# EAGLE design Controller (EAGLE 9.5.1)

## Sheet 1 of 4
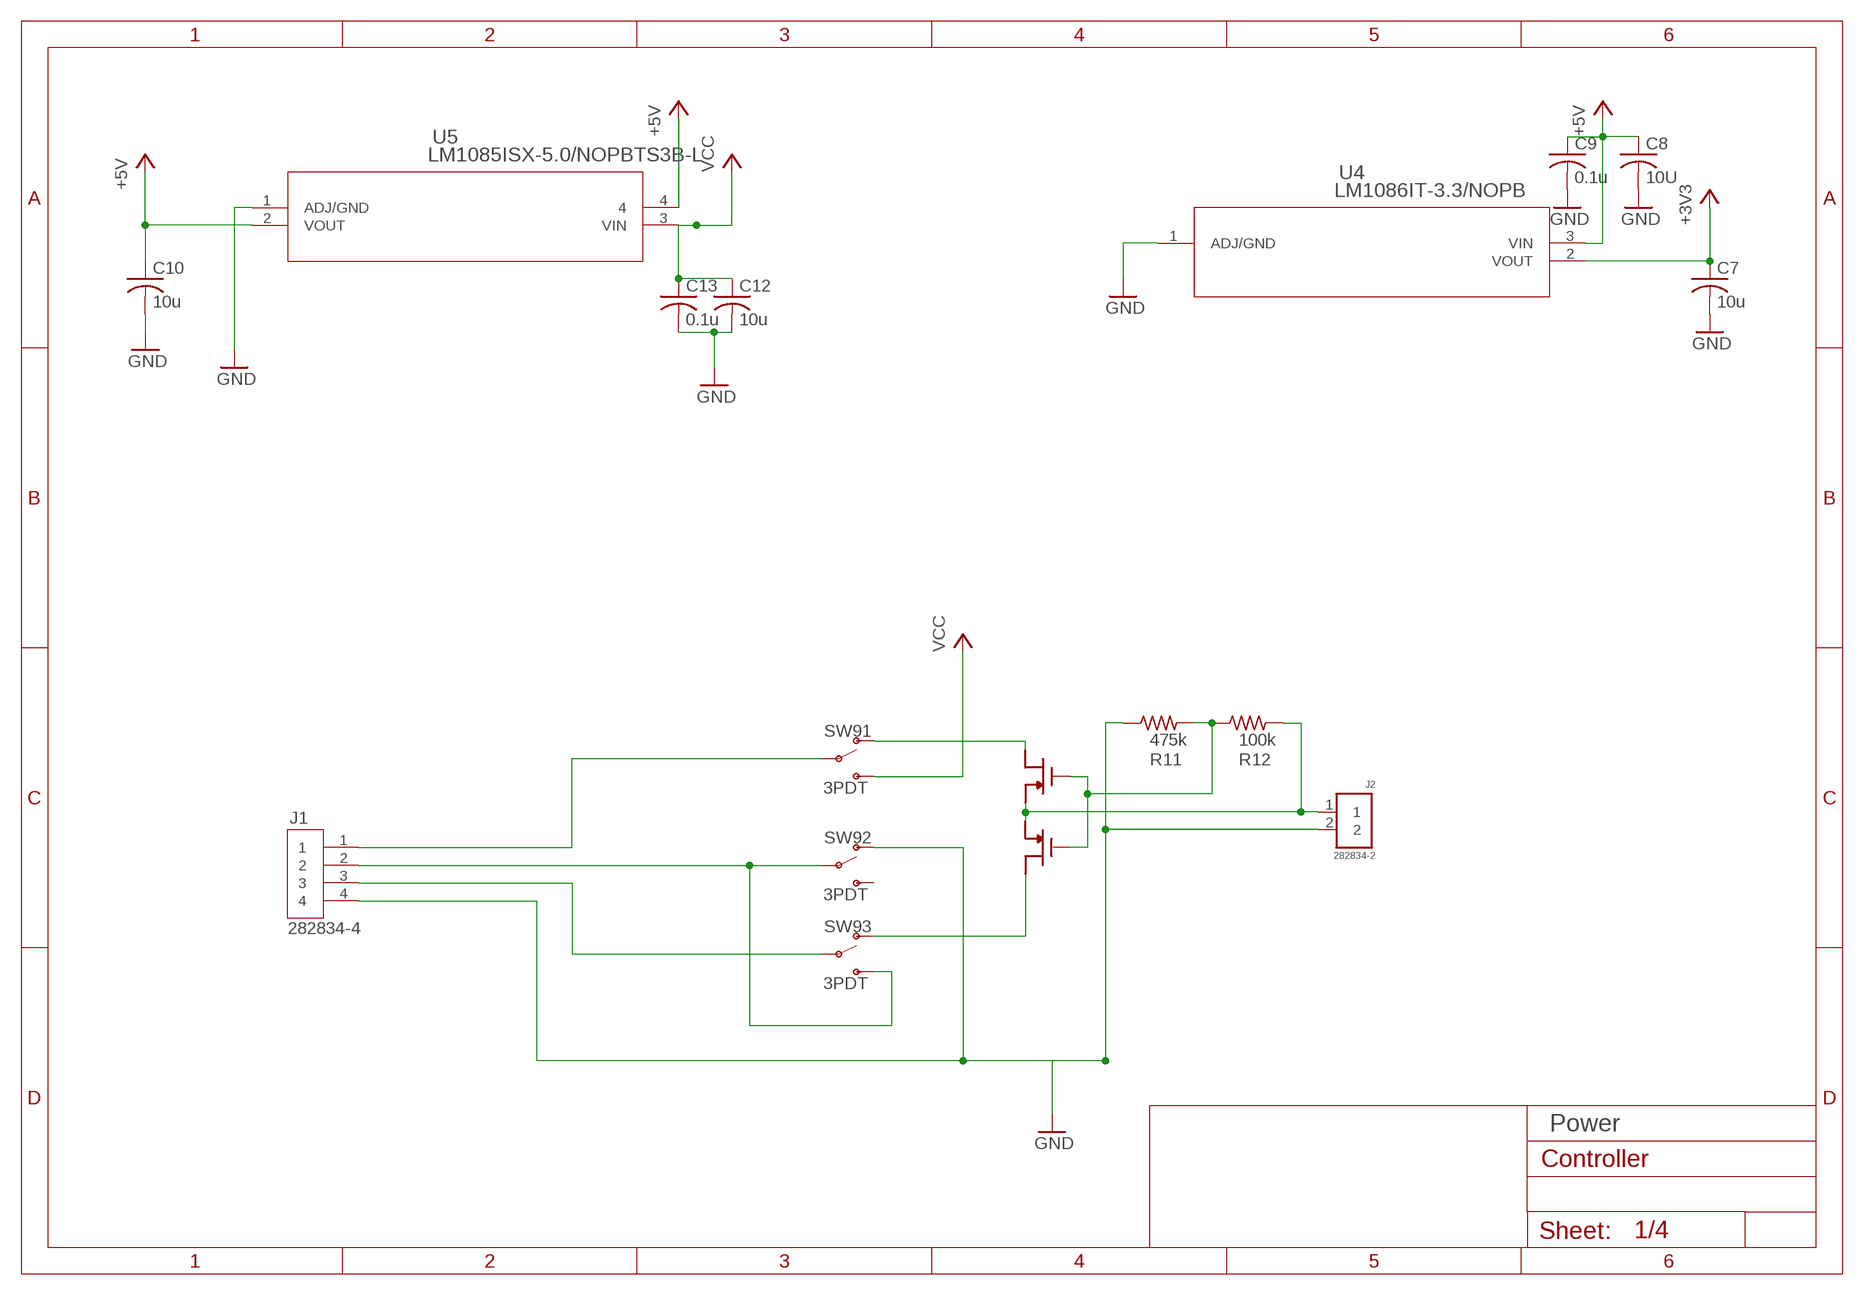
[diagram p0: schematic, sheet 1]

### Parts
C7  10u  C-USC1206  [C1206]
C8  10U  C-USC1206  [C1206]
C9  0.1u  C-USC1206  [C1206]
C10  10u  C-USC1206  [C1206]
C12  10u  C-USC1206  [C1206]
C13  0.1u  C-USC1206  [C1206]
J1  282834-4  [HDRV4W85P254_4X1_1062X650X1000]
J2  282834-2  [CONN_282834-2]
R11  475k  R-US_R1206  [R1206]
R12  100k  R-US_R1206  [R1206]
SW9  3PDT  [3PDT]
U4  LM1086IT-3.3/NOPB  [T03B]
U5  LM1085ISX-5.0/NOPBTS3B-L  [TS3B-L]
U6  SSM6P40TULFCT-ND  [SMD6]

### Nets
+3V3: C7.1 U4.2(VOUT) ; also sheet 4
+5V: C8.1 C9.1 C10.1 U4.3(VIN) U5.2(VOUT) U5.4 ; also sheet 2,3,4
GND: C7.2 C8.2 C9.2 C10.2 C12.2 C13.2 J1.4 J2.2 R11.1 SW9.T21(2:O) U4.1(ADJ/GND) U5.1(ADJ/GND) ; also sheet 2,3,4
N$9: J1.1 SW9.P1(1:P)
N$10: J1.2 SW9.P2(2:P) SW9.T32(3:S)
N$11: J1.3 SW9.P3(3:P)
N$12: SW9.T31(3:O) U6.P$3(D)
N$13: J2.1 R12.2 U6.P$1(S) U6.P$4(S)
N$15: SW9.T11(1:O) U6.P$6(D)
N$19: R11.2 R12.1 U6.P$2(G) U6.P$5(G)
VCC: C12.1 C13.1 SW9.T12(1:S) U5.3(VIN)
Unconnected: SW9.T22(2:S)

### Notes on the sheet
- Power

## Sheet 2 of 4
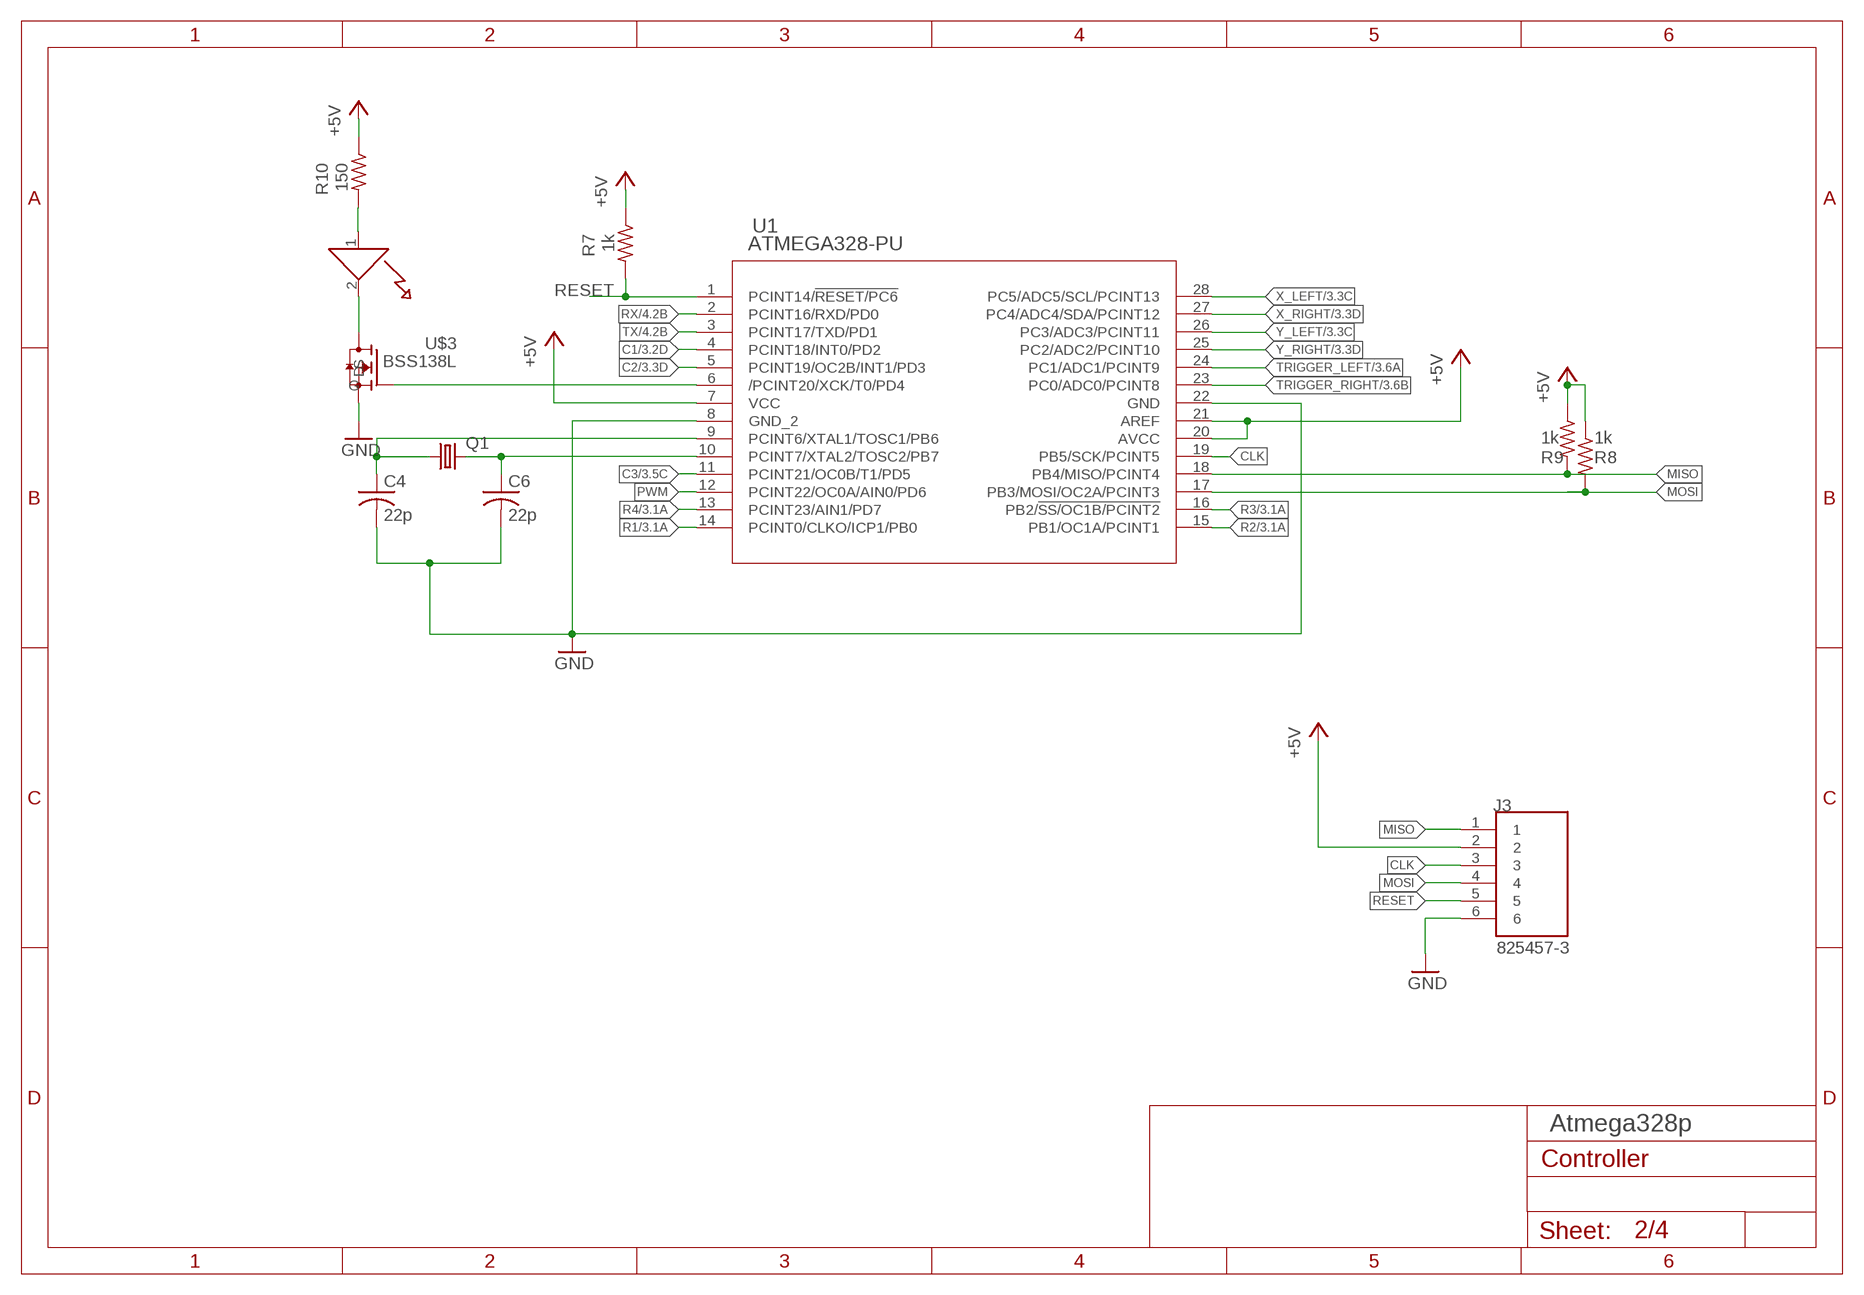
[diagram p1: schematic, sheet 2]

### Parts
C4  22p  C-USC1206  [C1206]
C6  22p  C-USC1206  [C1206]
J3  825457-3  [TE_825457-3]
Q1  CRYSTALHC49S  [HC49/S]
R7  1k  R-US_R1206  [R1206]
R8  1k  R-US_R1206  [R1206]
R9  1k  R-US_R1206  [R1206]
R10  150  R-US_R1206  [R1206]
U1  ATMEGA328-PU  [28P3]
U$2  LED  [R1206W]
U$3  BSS138L  [BSS138L]

### Nets
+5V: J3.2 R7.1 R8.1 R9.1 R10.1 U1.7(VCC) U1.20(AVCC) U1.21(AREF) ; also sheet 1,3,4
C1: U1.4(PCINT18/INT0/PD2) ; also sheet 3
C2: U1.5(PCINT19/OC2B/INT1/PD3) ; also sheet 3
C3: U1.11(PCINT21/OC0B/T1/PD5) ; also sheet 3
CLK: J3.3 U1.19(PB5/SCK/PCINT5)
GND: C4.2 C6.2 J3.6 U1.8(GND_2) U1.22(GND) U$3.S ; also sheet 1,3,4
MISO: J3.1 R9.2 U1.18(PB4/MISO/PCINT4)
MOSI: J3.4 R8.2 U1.17(PB3/MOSI/OC2A/PCINT3)
N$3: C4.1 Q1.1 U1.9(PCINT6/XTAL1/TOSC1/PB6)
N$4: C6.1 Q1.2 U1.10(PCINT7/XTAL2/TOSC2/PB7)
N$6: U1.6(/PCINT20/XCK/T0/PD4) U$3.G
N$7: U$2.2 U$3.D
N$8: R10.2 U$2.1
PWM: U1.12(PCINT22/OC0A/AIN0/PD6)
R1: U1.14(PCINT0/CLKO/ICP1/PB0) ; also sheet 3
R2: U1.15(PB1/OC1A/PCINT1) ; also sheet 3
R3: U1.16(PB2/!SS/OC1B/PCINT2) ; also sheet 3
R4: U1.13(PCINT23/AIN1/PD7) ; also sheet 3
RESET: J3.5 R7.2 U1.1(PCINT14/!RESET/PC6)
RX: U1.2(PCINT16/RXD/PD0) ; also sheet 4
TRIGGER_LEFT: U1.24(PC1/ADC1/PCINT9) ; also sheet 3
TRIGGER_RIGHT: U1.23(PC0/ADC0/PCINT8) ; also sheet 3
TX: U1.3(PCINT17/TXD/PD1) ; also sheet 4
X_LEFT: U1.28(PC5/ADC5/SCL/PCINT13) ; also sheet 3
X_RIGHT: U1.27(PC4/ADC4/SDA/PCINT12) ; also sheet 3
Y_LEFT: U1.26(PC3/ADC3/PCINT11) ; also sheet 3
Y_RIGHT: U1.25(PC2/ADC2/PCINT10) ; also sheet 3

### Notes on the sheet
- Atmega328p

## Sheet 3 of 4
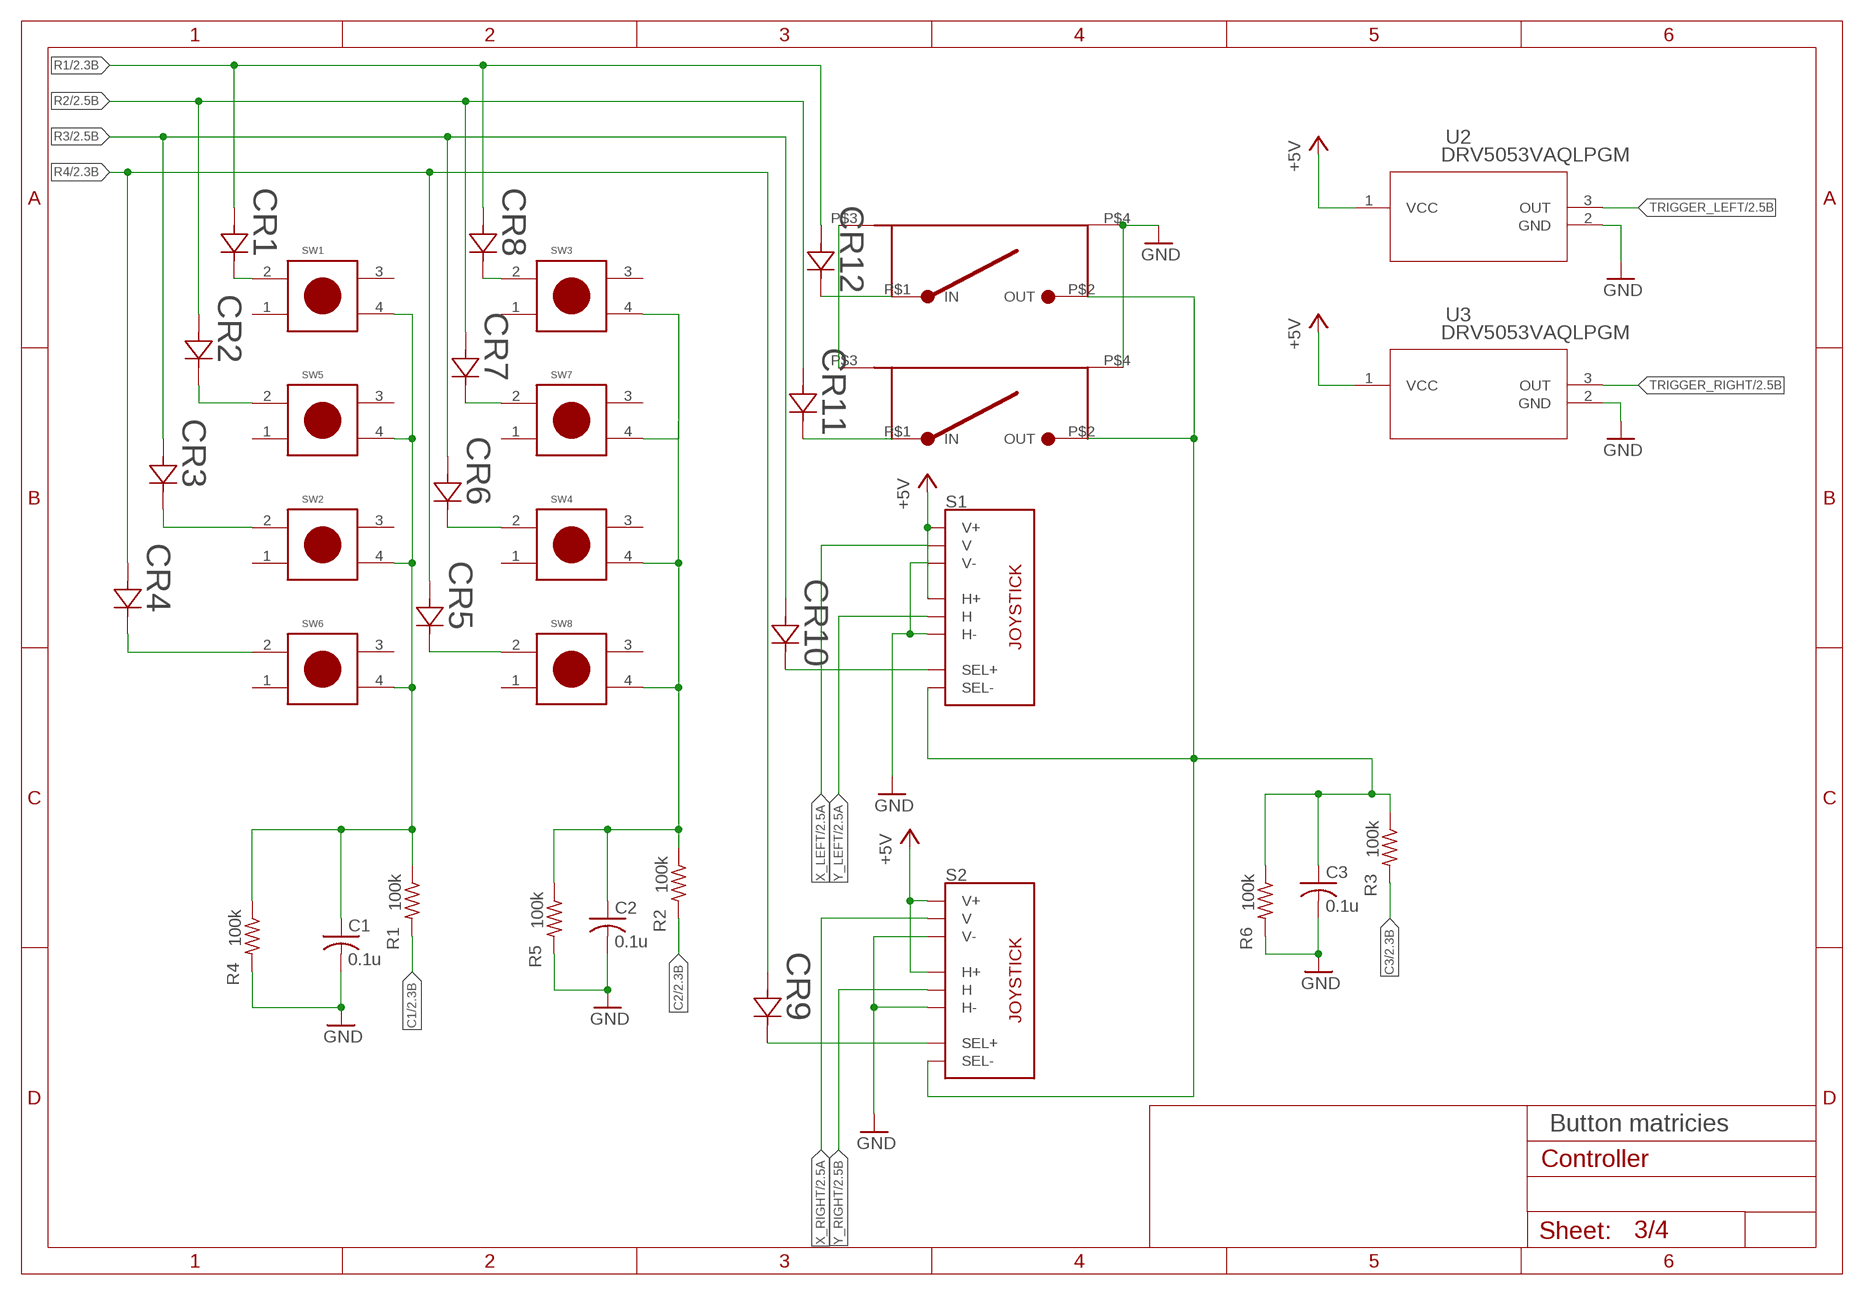
[diagram p2: schematic, sheet 3]

### Parts
C1  0.1u  C-USC1206  [C1206]
C2  0.1u  C-USC1206  [C1206]
C3  0.1u  C-USC1206  [C1206]
CR1  MSS1P6-M3/89ADIODE_MSP3V3-M  [DIODE_MSP3V3-M]
CR2  MSS1P6-M3/89ADIODE_MSP3V3-M  [DIODE_MSP3V3-M]
CR3  MSS1P6-M3/89ADIODE_MSP3V3-M  [DIODE_MSP3V3-M]
CR4  MSS1P6-M3/89ADIODE_MSP3V3-M  [DIODE_MSP3V3-M]
CR5  MSS1P6-M3/89ADIODE_MSP3V3-M  [DIODE_MSP3V3-M]
CR6  MSS1P6-M3/89ADIODE_MSP3V3-M  [DIODE_MSP3V3-M]
CR7  MSS1P6-M3/89ADIODE_MSP3V3-M  [DIODE_MSP3V3-M]
CR8  MSS1P6-M3/89ADIODE_MSP3V3-M  [DIODE_MSP3V3-M]
CR9  MSS1P6-M3/89ADIODE_MSP3V3-M  [DIODE_MSP3V3-M]
CR10  MSS1P6-M3/89ADIODE_MSP3V3-M  [DIODE_MSP3V3-M]
CR11  MSS1P6-M3/89ADIODE_MSP3V3-M  [DIODE_MSP3V3-M]
CR12  MSS1P6-M3/89ADIODE_MSP3V3-M  [DIODE_MSP3V3-M]
R1  100k  R-US_R1206  [R1206]
R2  100k  R-US_R1206  [R1206]
R3  100k  R-US_R1206  [R1206]
R4  100k  R-US_R1206  [R1206]
R5  100k  R-US_R1206  [R1206]
R6  100k  R-US_R1206  [R1206]
S1  THUMBPOINTER-RKJXV1224005  [THUMBPOINTER-RKJXV1224005]
S2  THUMBPOINTER-RKJXV1224005  [THUMBPOINTER-RKJXV1224005]
SW1  MULTICOLOR_BUTTON  [PRT-14460]
SW2  MULTICOLOR_BUTTON  [PRT-14460]
SW3  MULTICOLOR_BUTTON  [PRT-14460]
SW4  MULTICOLOR_BUTTON  [PRT-14460]
SW5  MULTICOLOR_BUTTON  [PRT-14460]
SW6  MULTICOLOR_BUTTON  [PRT-14460]
SW7  MULTICOLOR_BUTTON  [PRT-14460]
SW8  MULTICOLOR_BUTTON  [PRT-14460]
U2  DRV5053VAQLPGM  [LPG3]
U3  DRV5053VAQLPGM  [LPG3]
U$4  BUMPER_BUMPER  [BUMPER_BUMPER]
U$6  BUMPER_BUMPER  [BUMPER_BUMPER]

### Nets
$NC1: C1.1 R1.1 R4.1 SW1.4 SW2.4 SW5.4 SW6.4
+5V: S1.H1(H+) S1.V1(V+) S2.H1(H+) S2.V1(V+) U2.1(VCC) U3.1(VCC) ; also sheet 1,2,4
C1: R1.2 ; also sheet 2
C2: R2.2 ; also sheet 2
C3: R3.2 ; also sheet 2
GND: C1.2 C2.2 C3.2 R4.2 R5.2 R6.2 S1.H3(H-) S1.V3(V-) S2.H3(H-) S2.V3(V-) U2.2(GND) U3.2(GND) U$4.P$4(GROUND) U$6.P$4(GROUND) ; also sheet 1,2,4
N$2: CR4.1 SW6.2
N$5: U$4.P$3(GROUND1) U$6.P$3(GROUND1)
N$16: CR3.1 SW2.2
N$18: CR2.1 SW5.2
N$20: CR1.1 SW1.2
N$21: CR7.1 SW7.2
N$22: CR6.1 SW4.2
N$23: CR5.1 SW8.2
N$24: CR12.1 U$4.P$1(IN)
N$25: CR8.1 SW3.2
N$26: CR11.1 U$6.P$1(IN)
N$27: CR10.1 S1.B1A(SEL+)
N$28: CR9.1 S2.B1A(SEL+)
N$C2: C2.1 R2.1 R5.1 SW3.4 SW4.4 SW7.4 SW8.4
N$C3: C3.1 R3.1 R6.1 S1.B2A(SEL-) S2.B2A(SEL-) U$4.P$2(OUT) U$6.P$2(OUT)
R1: CR1.2 CR8.2 CR12.2 ; also sheet 2
R2: CR2.2 CR7.2 CR11.2 ; also sheet 2
R3: CR3.2 CR6.2 CR10.2 ; also sheet 2
R4: CR4.2 CR5.2 CR9.2 ; also sheet 2
TRIGGER_LEFT: U2.3(OUT) ; also sheet 2
TRIGGER_RIGHT: U3.3(OUT) ; also sheet 2
X_LEFT: S1.V2(V) ; also sheet 2
X_RIGHT: S2.V2(V) ; also sheet 2
Y_LEFT: S1.H2(H) ; also sheet 2
Y_RIGHT: S2.H2(H) ; also sheet 2
Unconnected: SW1.1 SW1.3 SW2.1 SW2.3 SW3.1 SW3.3 SW4.1 SW4.3 SW5.1 SW5.3 SW6.1 SW6.3 SW7.1 SW7.3 SW8.1 SW8.3

### Notes on the sheet
- Button matricies

## Sheet 4 of 4
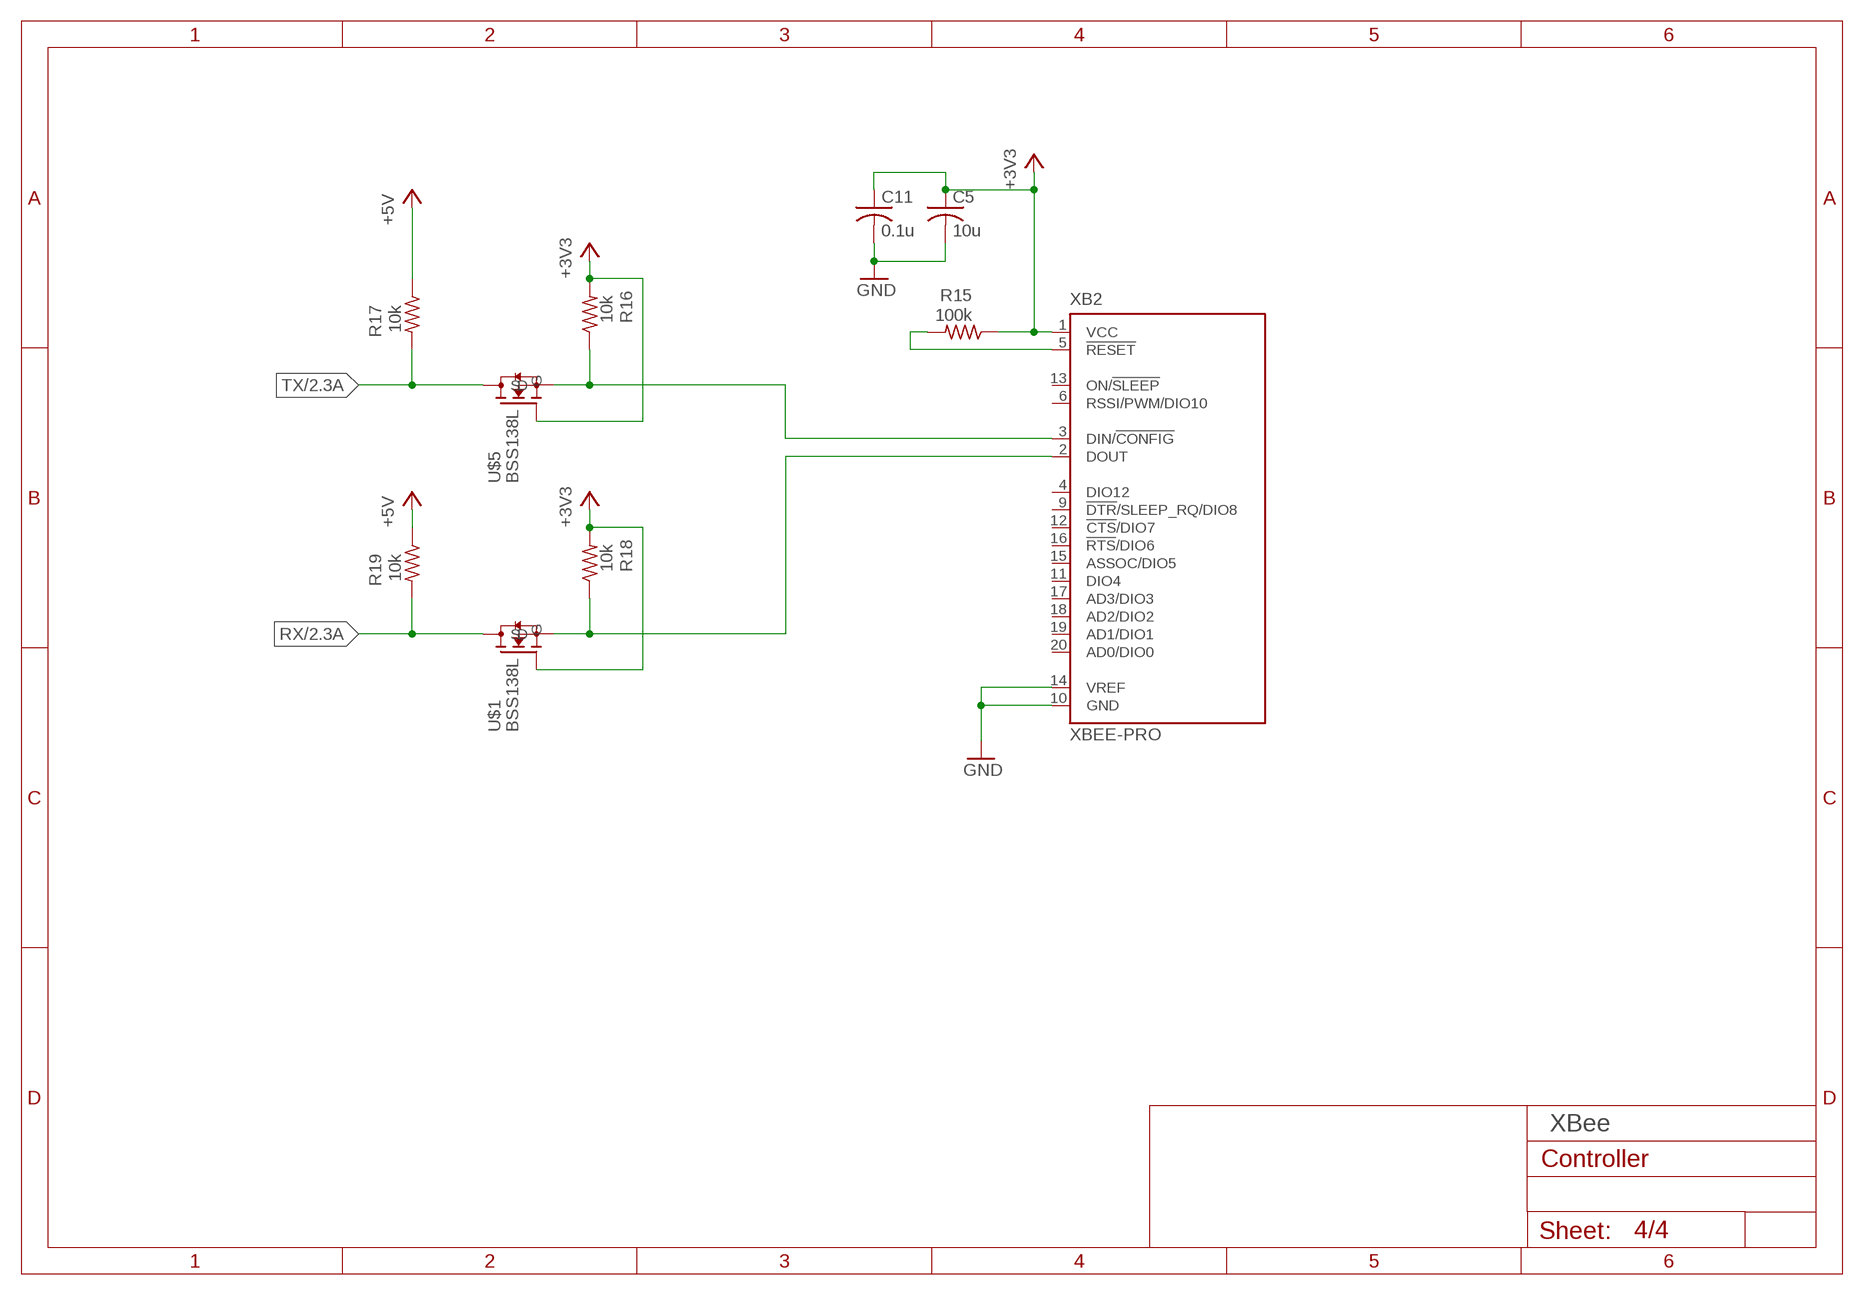
[diagram p3: schematic, sheet 4]

### Parts
C5  10u  C-USC1206  [C1206]
C11  0.1u  C-USC1206  [C1206]
R15  100k  R-US_R1206  [R1206]
R16  10k  R-US_R1206  [R1206]
R17  10k  R-US_R1206  [R1206]
R18  10k  R-US_R1206  [R1206]
R19  10k  R-US_R1206  [R1206]
U$1  BSS138L  [BSS138L]
U$5  BSS138L  [BSS138L]
XB2  XBEE-PRO  [XBEE-PRO]

### Nets
+3V3: C5.1 C11.1 R15.1 R16.2 R18.2 U$1.G U$5.G XB2.1(VCC) ; also sheet 1
+5V: R17.1 R19.1 ; also sheet 1,2,3
GND: C5.2 C11.2 XB2.10(GND) XB2.14(VREF) ; also sheet 1,2,3
N$1: R15.2 XB2.5(!RESET)
N$14: R16.1 U$5.S XB2.3(DIN/!CONFIG)
N$17: R18.1 U$1.S XB2.2(DOUT)
RX: R19.2 U$1.D ; also sheet 2
TX: R17.2 U$5.D ; also sheet 2
Unconnected: XB2.4(DIO12) XB2.6(RSSI/PWM/DIO10) XB2.9(!DTR!/SLEEP_RQ/DIO8) XB2.11(DIO4) XB2.12(!CTS!/DIO7) XB2.13(ON/!SLEEP) XB2.15(ASSOC/DIO5) XB2.16(!RTS!/DIO6) XB2.17(AD3/DIO3) XB2.18(AD2/DIO2) XB2.19(AD1/DIO1) XB2.20(AD0/DIO0)

### Notes on the sheet
- XBee

## Library data of the parts
C1-C13 = rcl:C-US: CAPACITOR, American symbol; SPICEPREFIX: C
CR1-CR12 = Controller:MSS1P6-M3/89A; MANUFACTURER_PART_NUMBER: MSS1P6M389A; VENDOR: Vishay
J1 = 282834-4:282834-4: Wire to Board 4 Position 2.54 mm Pitch 30-16 AWG Euro Style Terminal Block; CENTERLINE_PITCH: 2.54 mm[.1 in]; COMMENT: 282834-4; DESCRIPTION: Conn Terminal Block 4 POS 2.54mm Solder ST Thru-Hole 10A/Contact; DIGI-KEY_PART_NUMBER: A98335-ND; DIGI-KEY_PURCHASE_URL: https://www.digikey.com/product-detail/en/te-connectivity-amp-connectors/282834-4/A98335-ND/1153265?utm_source=snapeda&utm_medium=aggregator&utm_campaign=symbol; EU_ROHS_COMPLIANCE: Compliant with Exemptions; MF: TE Connectivity; MP: 282834-4; NUMBER_OF_POSITIONS: 4; PACKAGE: None; TE_PURCHASE_URL: https://www.te.com/usa-en/product-282834-4.html?te_bu=Cor&te_type=disp&te_campaign=seda_glo_cor-seda-global-disp-prtnr-fy19-seda-model-bom-cta_sma-317_1&elqCampaignId=32493
J2 = 282834-2:282834-2: Terminal block; 2.54mm; angled 90°; 0.03÷1mm2; ways: 2; 10A; H: 10mm; CENTERLINE_PITCH: 2.54 mm[.1 in]; COMMENT: 282834-2; DESCRIPTION: Wire-To-Board Terminal Block, 2, 150 V, 10 A, 30 Awg, 16 Awg, 1.4 Mm; DIGI-KEY_PART_NUMBER: A98333-ND; DIGI-KEY_PURCHASE_URL: https://www.digikey.com/product-detail/en/te-connectivity-amp-connectors/282834-2/A98333-ND/1150135?utm_source=snapeda&utm_medium=aggregator&utm_campaign=symbol; EU_ROHS_COMPLIANCE: Compliant with Exemptions; MF: TE Connectivity; MP: 282834-2; NUMBER_OF_POSITIONS: 2; PACKAGE: None; TE_PURCHASE_URL: https://www.te.com/usa-en/product-282834-2.html?te_bu=Cor&te_type=disp&te_campaign=seda_glo_cor-seda-global-disp-prtnr-fy19-seda-model-bom-cta_sma-317_1&elqCampaignId=32493
J3 = 825457-3:825457-3: MOD\ II\ HSG\ R\.A\.\ 3\ POS; CENTERLINE_PITCH: 2.54 mm[.1 in]; COMMENT: 825457-3; DESCRIPTION: MOD II HSG R.A. 3 POS; DIGI-KEY_PART_NUMBER: A122907-ND; DIGI-KEY_PURCHASE_URL: https://www.digikey.com/product-detail/en/te-connectivity-amp-connectors/825457-3/A122907-ND/5008513?utm_source=snapeda&utm_medium=aggregator&utm_campaign=symbol; EU_ROHS_COMPLIANCE: Compliant; MF: TE Connectivity; MP: 825457-3; NUMBER_OF_POSITIONS: 6; PACKAGE: None; PRODUCT_TYPE: Connector; TE_PURCHASE_URL: https://www.te.com/usa-en/product-825457-3.html?te_bu=Cor&te_type=disp&te_campaign=seda_glo_cor-seda-global-disp-prtnr-fy19-seda-model-bom-cta_sma-317_1&elqCampaignId=32493
Q1 = crystal:CRYSTAL: CRYSTAL; OC_FARNELL: 1667008; OC_NEWARK: unknown
R1-R12 R15-R19 = rcl:R-US_: RESISTOR, American symbol; SPICEPREFIX: R
S1 S2 = Controller:THUMBPOINTER-RKJXV1224005: ThumbPointer - RK JXV1224005 This is a joystick very similar to the joysticks on Xbox One and PS4 controllers. Directional movements are simply two potentiometers - one for each axis. Pots are ~10k each. This joystick also has a select button that is actuated when the joystick is pressed down. Additional Information <https://www.alps.com/prod/info/E/HTML/MultiControl/Potentiometer/RKJXK/RKJXV1224005.html>; PROD_ID: RKJXV1224005
SW1-SW8 = Controller:MULTICOLOR_BUTTON; SPICEPREFIX: S
SW9 = Controller:3PDT; DIGIKEY_PART_NUMBER: CWI359-ND
U1 = Controller:ATMEGA328-PU; MANUFACTURER_PART_NUMBER: ATMEGA328PU; VENDOR: Atmel
U2 U3 = Controller:DRV5053VAQLPGM; MANUFACTURER_PART_NUMBER: DRV5053VAQLPGM; VENDOR: Texas Instruments
U4 = Controller:LM1086IT-3.3/NOPB; MANUFACTURER_PART_NUMBER: LM1086IT3.3NOPB; VENDOR: Texas Instruments
U5 = Controller:LM1085ISX-5.0/NOPB; MANUFACTURER_PART_NUMBER: LM1085ISX5.0NOPB; VENDOR: Texas Instruments
U6 = Controller:SSM6P40TULFCT-ND; DIGIKEY_PART_NUMBER: SSM6P40TULFCT-ND
U$1 U$3 U$5 = BSS138L:BSS138L: BSS138L N-Channel Logic Level Enhancement Mode Field Effect Transistor; DESCRIPTION: Small Signal MOSFET 50V 200mA 3.5 Ohm Single N-Channel SOT-23 Logic Level; DIGI-KEY_PART_NUMBER: BSS138LCT-ND; DIGI-KEY_PURCHASE_URL: https://www.digikey.com/product-detail/en/on-semiconductor/BSS138L/BSS138LCT-ND/5044761?utm_source=snapeda&utm_medium=aggregator&utm_campaign=symbol; MF: ON Semiconductor; MP: BSS138L; PACKAGE: SOT-23 ON Semiconductor
U$2 = Controller:LED
U$4 U$6 = Controller:BUMPER_BUMPER
XB2 = Controller:XBEE: XBee (TM) /XBee-PRO(TM) OEM RF Modules Source: MaxStream, Inc. xbee_productmanual.pdf; MPN: XBP24-AWI-001; OC_FARNELL: 1337916; OC_NEWARK: 42M2667

## Board
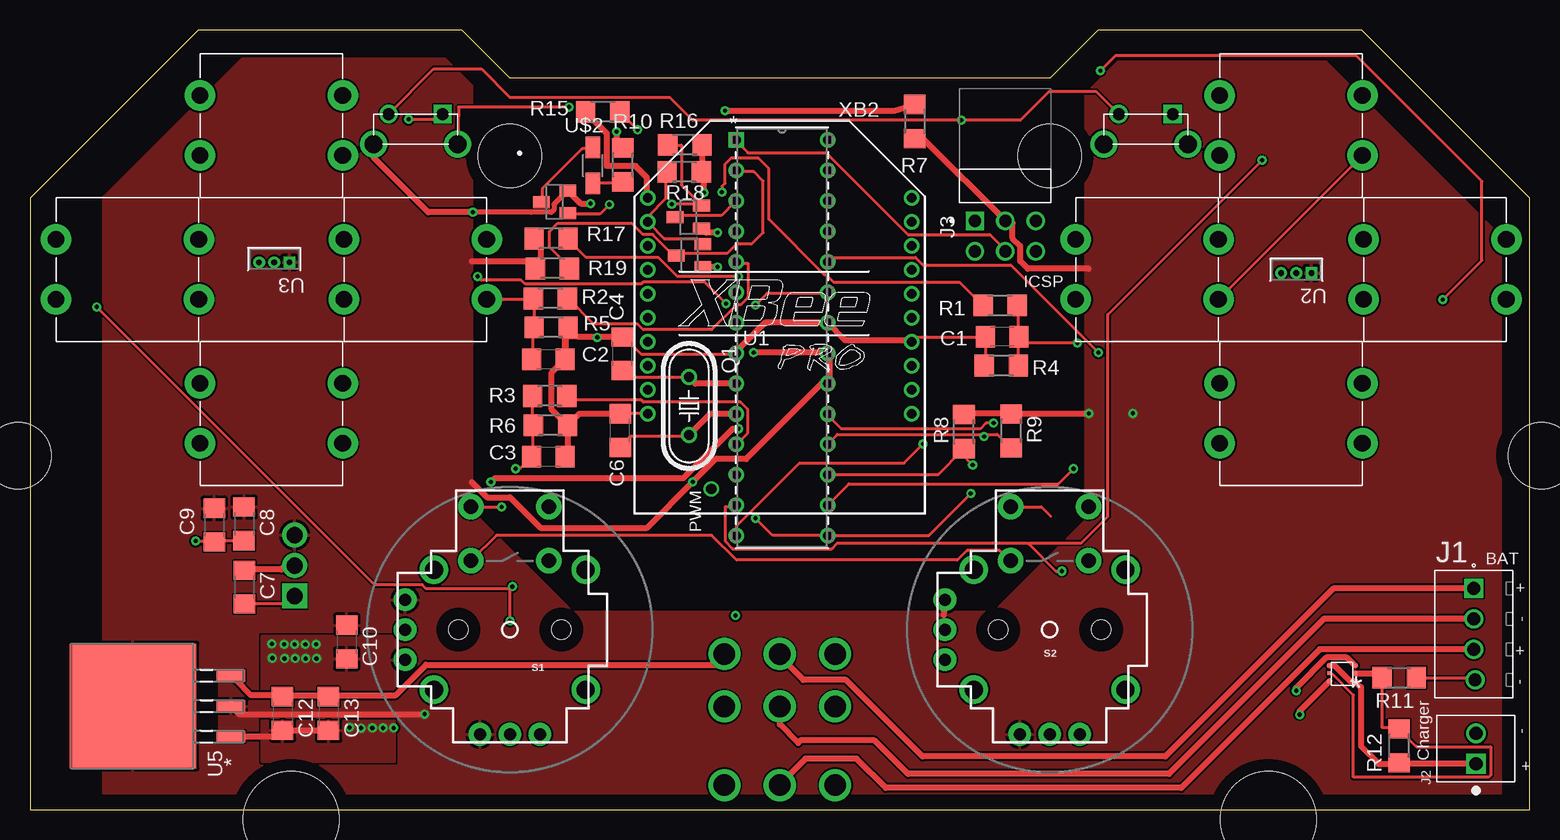
[diagram p4: board, top side]
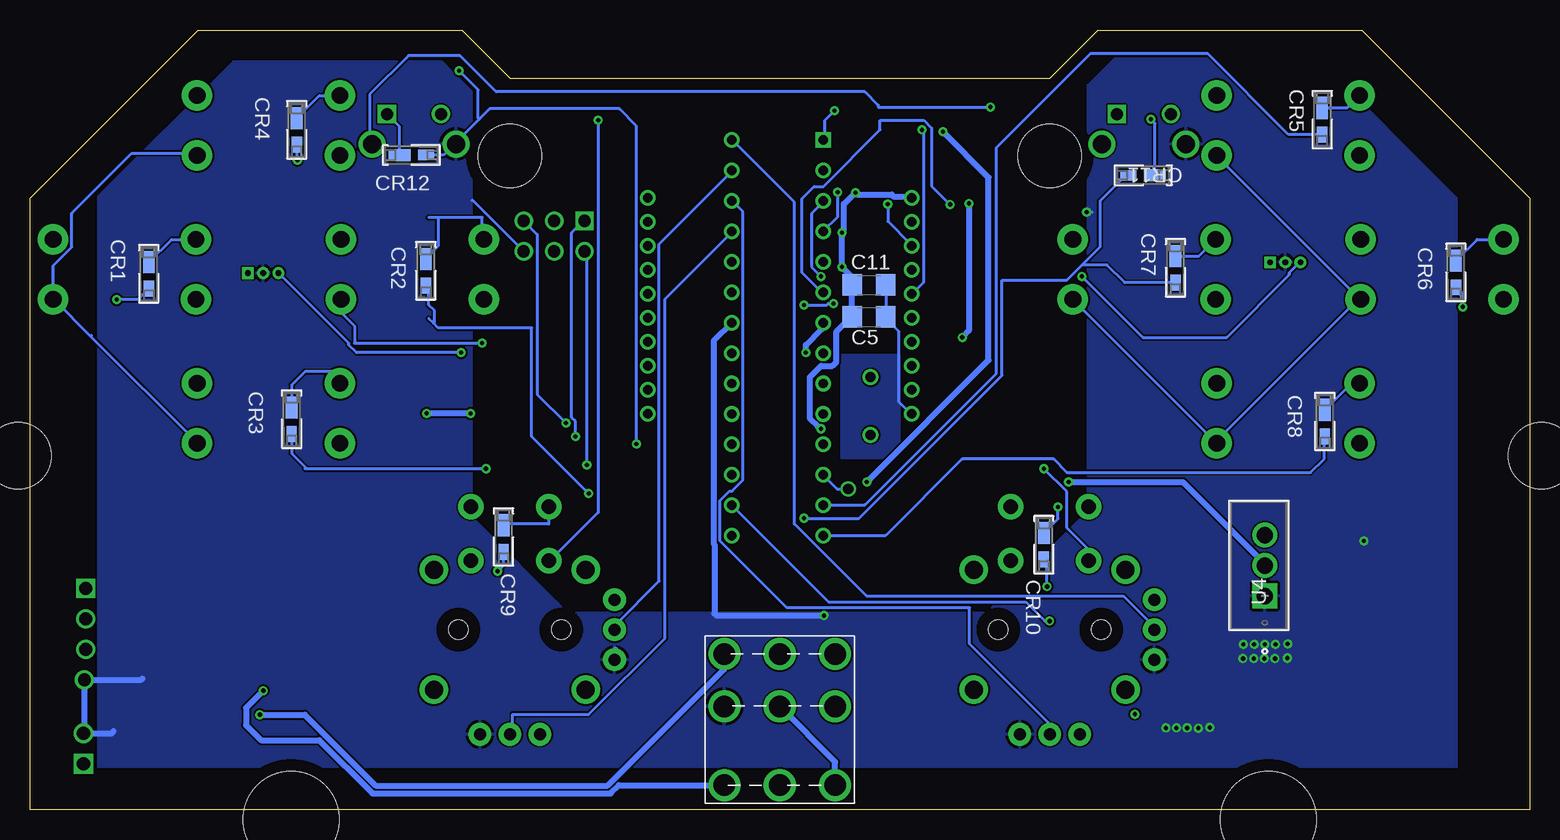
[diagram p5: board, bottom side, seen from below]

Size 125 x 65 mm. Coordinates in mm from the lower left corner, seen from the top.
Outline: 0,0 125,0 125,51 111,65 89,65 85,61 40,61 36,65 14,65 0,51 0,0
Copper layers (1*16): Top 0.035mm / dielectric 1.5mm / Bottom 0.035mm
Design rules "default *": minimum track width 10mil, minimum drill 0.35mm, track to track 6mil, track to pad 6mil, pad to pad 6mil, via to via 6mil, smd to smd 6mil, copper to edge 40mil, drill to drill 6mil, minimum pad ring 10mil, minimum via ring 8mil, stop-mask expansion 4mil, vias tented up to drill 0mil, thermal gap 10mil
Holes 5.5 mm at -1,29.5 126,29.5
Holes 8 mm at 21.77,-0.83 103.23,-0.83
Holes 5.25 mm at 40,54.5 85,54.5
tKeepout: area 52.6,29.4 to 57.3,38
bKeepout: area 52.5,29.3 to 57.4,38

### Footprints (pad centres in the part's own frame; a part is rotated, then mirrored left to right if it is on the bottom)
C1206 = smd 1.6 x 1.8: 1 -1.4,0; 2 1.4,0
DIODE_MSP3V3-M = smd 1.854 x 0.991: 1 -0.978,0 | smd 1.321 x 0.864: 2 1.245,0
HDRV4W85P254_4X1_1062X650X1000 = drill 1.06 square: 1 0,0 | drill 1.06: 2 2.54,0; 3 5.08,0; 4 7.62,0.1
CONN_282834-2 = drill 1.1 square: 1 -1.27,0 | drill 1.1: 2 1.27,0
TE_825457-3 = drill 1.016 square: 1 0,0 | drill 1.016: 2 2.54,0; 3 5.08,0; 4 0,-2.54; 5 2.54,-2.54; 6 5.08,-2.54
HC49/S = drill 0.813: 1 -2.413,0; 2 2.413,0
R1206 = smd 1.6 x 1.803: 1 -1.422,0; 2 1.422,0
THUMBPOINTER-RKJXV1224005 = drill 1.2 pad 2.1: B1A -3.25,10.25; B1B 3.25,10.25; B2A -3.25,5.75; B2B 3.25,5.75 | drill 1 pad 1.9: H1 -2.5,-8.73; H2 0,-8.73; H3 2.5,-8.73; V1 -8.73,2.5; V2 -8.73,0; V3 -8.73,-2.5 | drill 1.5 pad 2.4: MOUNT1 -6.325,5; MOUNT2 -6.325,-5; MOUNT3 6.325,-5; MOUNT4 6.325,5 | hole 1.6: -4.3,0; 4.3,0
PRT-14460 = drill 1.4 pad 2.54: 1 -5.83,-2.46; 2 -5.83,2.54; 3 6.07,2.54; 4 6.07,-2.46
3PDT = drill 1.778: P1 0,5.461; P2 0,1.092; P3 0,-5.461; T11 -4.623,5.461; T12 4.623,5.461; T21 -4.623,1.092; T22 4.623,1.092; T31 -4.623,-5.461; T32 4.623,-5.461
28P3 = drill 0.787 pad 1.295 square: 1 -7.62,33.02 | drill 0.787 pad 1.295: 2 -7.62,30.48; 3 -7.62,27.94; 4 -7.62,25.4; 5 -7.62,22.86; 6 -7.62,20.32; 7 -7.62,17.78; 8 -7.62,15.24; 9 -7.62,12.7; 10 -7.62,10.16; 11 -7.62,7.62; 12 -7.62,5.08; 13 -7.62,2.54; 14 -7.62,0; 15 0,0; 16 0,2.54; 17 0,5.08; 18 0,7.62; 19 0,10.16; 20 0,12.7; 21 0,15.24; 22 0,17.78; 23 0,20.32; 24 0,22.86; 25 0,25.4; 26 0,27.94; 27 0,30.48; 28 0,33.02
LPG3 = drill 0.48 square: 1 -2.54,0 | drill 0.48: 2 -1.27,0; 3 0,0
T03B = drill 1.372 pad 1.88 square: 1 -5.08,-1.016 | drill 1.372 pad 1.88: 2 -2.54,-1.016; 3 0,-1.016
TS3B-L = smd 0.965 x 2.388: 1 -2.54,-8.23; 2 0,-8.23; 3 2.54,-8.23 | smd 10.414 x 10.566: 4 0,-0.051
SMD6 = smd 0.4 x 0.3: P$1 -1.05,0.65; P$2 -1.05,0; P$3 -1.05,-0.65; P$4 1.05,-0.65; P$5 1.05,0; P$6 1.05,0.65
BSS138L = smd 1 x 1.4: D 0,1.1; G -0.95,-1.1; S 0.95,-1.1
R1206W = smd 1.8 x 1.2: 1 -1.499,0; 2 1.499,0
BUMPER_BUMPER = drill 1 pad 1.5 square: P$1 -2.25,0 | drill 1 pad 1.5: P$2 2.25,0 | drill 1.5 pad 2: P$3 -3.5,2.5; P$4 3.5,2.5
XBEE-PRO = drill 0.8 pad 1.27: 1 -11,9; 2 -11,7; 3 -11,5; 4 -11,3; 5 -11,1; 6 -11,-1; 7 -11,-3; 8 -11,-5; 9 -11,-7; 10 -11,-9; 11 11,-9; 12 11,-7; 13 11,-5; 14 11,-3; 15 11,-1; 16 11,1; 17 11,3; 18 11,5; 19 11,7; 20 11,9

### Placement (x,y rotation side)
C1  81.05,39.42 180 top
C2  43.22,37.55 0 top
C3  43.22,29.43 0 top
C4  49.38,38 90 top
C5  55.06,41.08 0 bottom
C6  49.2,31.59 90 top
C7  17.87,18.55 270 top
C8  17.84,23.82 270 top
C9  15.37,23.72 270 top
C10  26.41,13.97 270 top
C11  55.06,43.74 0 bottom
C12  21.05,8.02 270 top
C13  24.88,8.01 270 top
CR1  115.09,44.67 270 bottom
CR2  92,44.92 270 bottom
CR3  103.19,32.55 270 bottom
CR4  102.76,56.67 270 bottom
CR5  17.29,57.52 270 bottom
CR6  6.14,44.79 270 bottom
CR7  29.51,45.17 270 bottom
CR8  17.06,32.35 270 bottom
CR9  85.53,22.73 270 bottom
CR10  40.49,22.09 270 bottom
CR11  32.2,52.89 180 bottom
CR12  93.21,54.58 0 bottom
J1  120.36,18.44 270 top
J2  120.54,5.08 90 top
J3  78.76,49.09 0 top
Q1  54.94,33.65 270 top
R1  80.88,42.04 180 top
R2  43.38,42.6 0 top
R3  43.33,34.48 0 top
R4  80.96,37.02 180 top
R5  43.44,40.2 0 top
R6  43.39,32.04 0 top
R7  73.74,57.36 90 top
R8  77.85,31.51 270 top
R9  81.8,31.56 270 top
R10  49.42,53.75 270 top
R11  114.14,11 180 top
R12  114.14,5.31 270 top
R15  47.74,58.17 0 top
R16  54.59,55.43 0 top
R17  43.44,47.6 0 top
R18  54.53,53.16 0 top
R19  43.54,45.1 0 top
S1  40,15 0 top
S2  85,15 0 top
SW1  117,45 0 top
SW2  105,33 0 top
SW3  20,33 0 top
SW4  8,45 0 top
SW5  93,45 0 top
SW6  105,57 0 top
SW7  32,45 0 top
SW8  20,57 0 top
SW9  62.5,7.5 0 bottom
U1  66.5,22.82 0 top
U2  104.29,44.74 180 top
U3  19.09,45.63 180 top
U4  23.08,22.89 90 bottom
U5  8.53,8.62 90 top
U6  109.39,11.36 180 top
U$1  54.98,46.2 90 top
U$2  46.91,53.7 90 top
U$3  43.73,50.66 90 top
U$4  93,58 180 top
U$5  54.88,49.39 90 top
U$6  32.16,58 180 top
XB2  62.5,42 0 top

### Tracks (layer width: path | path; a pad name or v marks a point on that pad's centre or on a via)
$NC1  (via drill 0.35)
  Top 0.254: 82.39,38.89 82.39,37.15 R4.1 | 82.39,38.89 82.39,39.37 C1.1 | R1.1 82.39,41.91 82.39,39.53 C1.1 | v87.31,38.89 82.39,38.89 | 82.39,38.89 C1.1 | SW5.4 SW6.4
  Bottom 0.254: v87.31,38.89 97.95,38.89 97.95,40.32 99.06,41.43 99.06,42.39 SW5.4 99.22,42.55 | 119.94,39.45 123.03,42.55 SW1.4 123.07,45.35 121.52,46.9 121.52,49.72 116.51,54.73 111.24,54.73 110.97,54.45 | 119.94,39.45 111.12,30.64 SW2.4 | 111.12,54.45 SW6.4 110.97,54.45 | 119.86,39.53 119.94,39.45 | 110.97,54.45 110.97,54.29
+3V3  (via drill 0.35)
  Top 0.508: R15.1 46.35,58.1 48.1,56.36 48.1,53.66 50.48,53.66 51.44,52.7 51.44,51.12 XB2.1 | C7.1 17.94,20 20.95,20 21.27,20.32 21.91,20.32 U4.2 | R16.2 56.04,55.4 56.04,53.18 R18.2 56.2,53.02 v56.2,51.44 | v57.31,45.24 56.2,45.24 U$1.G | v57.31,48.1 56.36,48.1 56.04,48.42 U$5.G | v38.42,27.3 38.73,27.62 54.45,27.62 58.58,31.75 v59.05,31.75
  Bottom 0.508: v38.42,27.3 28.89,27.3 22.07,20.48 U4.2 | XB2.1 51.59,51.12 53.02,51.12 53.18,51.28 56.04,51.28 v56.2,51.44 57.15,50.48 57.15,48.26 v57.31,48.1 v57.31,45.24 56.52,44.45 56.52,43.81 C11.1 56.52,43.5 56.52,41.12 C5.1 56.67,40.96 57.78,39.85 57.78,37.32 58.11,36.99 59.05,36.99 60.01,36.04 60.01,32.62 59.32,31.93 59.23,31.93 v59.05,31.75
+5V  (via drill 0.35)
  Top 0.508: v48.9,56.52 48.9,55.24 R10.1 | v60.33,38.1 66.04,38.1 U1.21 66.67,37.47 66.67,35.56 U1.20 66.04,35.56 59.69,29.21 57.15,29.21 v55.24,27.3 51.44,23.5 42.55,23.5 40.01,26.04 38.1,26.04 36.83,27.3 | R8.1 78.11,33.02 81.28,33.02 R9.1 81.92,33.02 v88.27,33.02 | R17.1 42.55,46.99 42.55,45.72 R19.1 41.91,45.72 36.83,45.72 | 88.27,45.09 83.19,45.09 82.55,45.72 82.55,46.99 81.92,47.62 81.92,48.9 J3.2 74.45,55.94 R7.1 | S2.V1 76.2,17.14 76.2,16.51 76.15,16.22 | U5.2 17.43,7.95 v32.9,7.95
  Bottom 0.508: v48.9,56.52 45.09,52.7 45.09,37.47 v55.24,27.3 | v60.33,38.1 60.33,38.73 59.05,40.01 U1.7 | v88.27,33.02 91.94,33.02 91.95,33.02 v91.94,33.04
  pour Top (rank 2): 6.06,51.01 6.06,1.35 122.66,1.35 122.66,47.76 108.06,62.36 90.66,62.36 87.95,59.65 87.95,24.1 80.33,16.48 45.26,16.48 36.89,24.85 36.89,60.34 34.62,62.6 17.65,62.6
C1  (via drill 0.35)
  Top 0.254: R1.2 79.38,42.07 77.47,43.97 66.99,43.97 66.36,44.61 66.2,44.61 61.59,49.21 61.59,53.42 60.73,54.29 58.42,54.29 57.94,53.82 57.94,52.23 57.67,51.96 v57.67,51.49 | 58.9,48.26 U1.4
  Bottom 0.254: v57.67,51.49 57.67,50.71 57.68,50.7 57.68,49.42 U1.4
C2
  Top 0.254: R2.2 44.93,42.55 46.99,40.48 50.64,40.48 51.12,40.01 56.83,40.01 58.9,42.07 59.21,42.07 59.85,42.7 59.85,45.56 58.9,45.56 U1.5
C3
  Top 0.254: R3.2 44.77,34.45 45.09,34.13 50.96,34.13 51.12,33.97 59.21,33.97 59.85,33.34 59.85,31.41 U1.11
CLK  (via drill 0.35)
  Top 0.254: v80.33,32.23 79.69,32.23 79.22,31.75 67.63,31.75 66.52,32.86 U1.19
  Bottom 0.254: v80.33,32.23 82.71,34.61 82.71,47.94 83.82,49.05 J3.3
GND  (via drill 0.35)
  Top 0.254: XB2.10 51.44,33.02 49.54,33.02 49.21,33.02 C6.2 49.05,32.86 45.72,32.86 44.93,32.07 R6.2 | R4.2 79.69,37.15 79.69,39.37 C1.2 79.53,39.37 73.82,39.37 73.59,39.14 73.5,39.05 XB2.14 73.34,39.05 | 44.77,39.37 44.77,40.16 R5.2 44.77,39.37 | 44.77,39.37 44.77,37.62 C2.2 | 44.77,39.37 v47.29,39.37 49.37,39.37 C4.2 49.53,39.37 50.96,37.94 58.6,37.94 58.74,37.94 U1.8 58.9,38.1 61.28,40.48 66.36,40.48 U1.22 66.52,40.48 | C8.2 17.78,22.38 15.4,22.38 C9.2 15.24,22.38 v13.81,22.38 | C7.2 17.94,17.14 21.27,17.14 21.91,17.78 U4.1 | R11.1 115.57,10.95 120.33,10.95 J1.4 | 28.66,54.34 U$6.P$4
  Top 0.406: U$3.S 43.68,50.47 43.68,50.02 43.47,49.81 41.78,49.81 41.77,49.81 v36.92,49.81
  Top 0.508: U5.1 20.52,6.08 C12.2 C13.2 | v36.92,49.81 33.19,49.81 30.25,52.75 28.66,54.34 | R6.2 44.8,32.04 43.5,33.34 43.5,36.44 C2.2 44.62,39.96 R5.2 45.66,39.4 C4.2 | R6.2 45.79,33.02 49.54,33.02 | R6.2 44.81,29.16 44.56,28.91 44.56,29.38 C3.2 | U$3.S 45.9,50.54 v46.74,50.54 | 58.6,37.94 61.26,40.6 U1.22 67.96,39.14 73.59,39.14
  Bottom 0.254: C11.2 53.66,43.66 53.66,41.12 C5.2 53.66,40.96 52.55,39.85 52.55,33.97 51.59,33.02 XB2.10 | 36.44,49.81 v36.92,49.81 | J3.6 83.98,46.67 88.11,50.8 88.15,50.8
  Bottom 0.508: 115.61,10.93 115.72,10.82 J1.4 120.46,6.42 J2.2 118.22,6.34 118.03,6.54 | 76.2,13.34 S2.V3 | v46.74,50.54 46.74,39.92 v47.29,39.37 | U1.22 68,39.1 68,22.16 67.94,22.11 67.94,16.35 67.76,16.17 v58.81,16.17
  other vias: 20.16,13.81 21.18,13.78 22.06,13.78 22.95,13.78 23.84,13.78 20.2,12.62 21.21,12.59 22.1,12.59 22.99,12.59 23.88,12.59 26.64,6.84 27.61,6.79 28.54,6.8 29.43,6.8 30.32,6.8
  pour Bottom (rank 2): 6.05,51 17.65,62.6 34.62,62.6 36.86,60.36 36.86,24.84 45.29,16.41 80.17,16.41 88.15,24.39 88.15,59.88 90.65,62.38 108.08,62.38 119.36,51.09 119.36,3.55 6.05,3.55
  pour Bottom: 52.54,37.92 52.54,29.29 57.34,29.29 57.34,37.92
  pour Top: 19.32,14.44 19.32,4.01 30.4,4.01 30.4,14.45 19.32,14.45
MISO  (via drill 0.35)
  Top 0.254: 79.53,31.27 67.31,31.27 66.52,30.48 U1.18 | 79.53,31.27 80.64,31.27 81.76,30.16 R9.2 | 79.53,31.27 v79.53,31.11
  Bottom 0.254: v79.53,31.11 79.53,32.38 79.85,32.7 79.85,48.1 78.9,49.05 J3.1
MOSI  (via drill 0.35)
  Top 0.254: U1.17 66.52,27.94 75.72,27.94 77.79,30 R8.2 77.63,29.69 v78.58,28.73
  Bottom 0.254: v78.58,28.73 78.58,46.35 78.74,46.51 J3.4
N$1  (via drill 0.35)
  Top 0.254: v50.64,56.67 49.21,58.1 R15.2
  Bottom 0.254: v50.64,56.67 50.48,56.52 50.48,43.97 51.44,43.02 XB2.5
N$2
  Bottom 0.254: 99.22,60.01 99.22,59.69 SW6.2 100.88,59.54 CR4.1
N$3
  Top 0.254: C4.1 49.53,36.51 50.01,36.04 54.77,36.04 Q1.1
  Top 0.508: U1.9 55.48,35.52 Q1.1
N$4
  Top 0.254: C6.1 49.21,30.32 50.01,31.11 54.77,31.11 Q1.2
  Top 0.508: U1.10 56.68,32.98 Q1.2
N$5  (via drill 0.35)
  Top 0.254: v44.93,58.58 35.72,58.58 U$6.P$3
  Bottom 0.254: v44.93,58.58 54.29,58.58 54.29,58.74 55.4,59.85 86.14,59.85 89.15,62.87 93.45,62.87 96.68,59.64 96.68,55.68 U$4.P$3
N$6  (via drill 0.35)
  Top 0.254: v48.3,50.45 47.51,49.66 44.88,49.66 U$3.G
  Bottom 0.254: v48.3,50.45 49.85,52 49.85,56.83 50.48,57.47 54.13,57.47 54.13,56.67 58.85,51.95 59.64,51.95 60.64,50.95 60.64,44.77 58.9,43.02 U1.6
N$7
  Top 0.254: U$3.D 42.7,50.8 42.7,51.75 46.04,55.09 46.83,55.09 U$2.2
N$8
  Top 0.254: U$2.1 46.99,52.23 49.37,52.23 R10.2
N$9
  Top 0.508: J1.1 108.64,18.44 94.64,4.44 74.41,4.44 68.04,10.81 64.47,10.81 62.5,12.79 SW9.P1
N$10
  Top 0.508: J1.2 107.87,15.9 94.94,2.96 73.2,2.96 70.4,5.76 64.22,5.76 64.03,5.56 62.5,7.09 SW9.P2
  Bottom 0.508: SW9.T32 57.88,3.97 SW9.P2
N$11
  Top 0.508: J1.3 107.52,13.36 95.97,1.81 71.34,1.81 68.9,4.25 64.62,4.25 62.5,2.12 SW9.P3
N$12  (via drill 0.35)
  Top 0.508: U6.P$3 109.76,12.69 108.08,12.69 105.55,10.16 v105.55,9.91
  Bottom 0.508: v105.55,9.91 107,8.46 107,7.04 105.74,5.78 100.88,5.78 96.45,1.34 76.6,1.34 75.9,2.04 SW9.T31
N$13
  Top 0.508: J2.1 114.22,3.81 | 114.22,3.81 R12.2 | U6.P$4 108.72,12.01 110.03,10.71 U6.P$1 110.95,10.2 110.95,5.28 112.42,3.81 114.22,3.81
N$14  (via drill 0.35)
  Top 0.254: R16.1 53.18,55.4 54.29,55.4 54.29,52.07 55.88,50.48 U$5.S 55.83,50.48 v53.5,50.48
  Bottom 0.254: v53.5,50.48 53.5,49.05 51.59,47.15 XB2.3
N$15  (via drill 0.35)
  Top 0.508: U6.P$6 105.84,8.21 v105.84,7.91
  Bottom 0.508: v105.84,7.91 102.09,7.91 96.17,2 76.87,2 67.12,11.75 SW9.T11
N$16
  Bottom 0.254: SW2.2 99.22,35.56 99.22,36.51 102.08,36.51 103.19,35.4 CR3.1
N$17
  Top 0.254: U$1.S 56.04,47.15 55.56,47.62 52.86,47.62 51.59,48.9 XB2.2 51.59,49.05 51.59,49.53 53.02,50.96 53.02,53.02 R18.1
N$18
  Bottom 0.254: 90.96,49.37 87.31,49.37 87.31,47.62 SW5.2 | 90.96,49.37 91.76,49.37 | 90.96,49.37 90.96,46.99 91.92,46.04 CR2.1
N$19
  Top 0.254: U6.P$5 108.43,11.27 108.58,11.27 110.33,9.53 110.33,2.7 121.6,2.7 121.76,2.86 121.76,5.24 115.57,5.24 114.14,6.67 R12.1 113.98,6.83 112.71,6.83 112.71,10.79 R11.2
  Top 0.508: U6.P$2 112.35,11.36 R11.2
N$20
  Bottom 0.254: 111.28,47.62 SW1.2 113.2,47.54 CR1.1
N$21
  Bottom 0.254: CR7.1 27.56,46.15 SW7.2
N$22
  Bottom 0.254: CR6.1 4.36,47.54 SW4.2
N$23
  Bottom 0.254: 14.29,59.69 SW8.2 15.21,58.5 CR5.1 17.14,58.58
N$24
  Bottom 0.254: U$4.P$1 94.19,56.94 CR12.1
N$25
  Bottom 0.254: SW3.2 14.85,35.54 CR8.1
N$26  (via drill 0.35)
  Top 0.254: v31.56,57.56 33.81,57.56 34.07,57.66 U$6.P$1
  Bottom 0.254: 31.56,53.23 CR11.1 31.22,57.22 v31.56,57.56
N$27  (via drill 0.35)
  Top 0.254: 39.32,25.26 v39.3,25.24 36.83,25.24 S1.B1A
  Bottom 0.254: CR10.1 39.3,24.25 v39.3,25.24
N$28
  Top 0.254: 85.09,24.45 84.3,25.24 S2.B1A
  Bottom 0.254: CR9.1 85.41,23.81 81.76,23.81 S2.B1A
N$C2
  Top 0.254: C2.1 41.91,37.62 41.91,40.16 R5.1 42.07,40.32 42.07,42.55 R2.1 41.91,42.55 38.1,42.55 SW7.4
  Bottom 0.254: SW8.4 26.04,54.45 14.13,42.55 SW4.4 14.29,42.55 26.04,30.8 26.04,30.64 SW3.4 26.19,30.64 37.94,42.39 SW7.4
N$C3  (via drill 0.35)
  Top 0.254: R3.1 41.91,34.45 41.91,32.07 R6.1 41.91,31.91 41.91,29.53 C3.1 41.75,29.37 40.8,28.42 v40.48,28.42 | S1.B2A 36.83,20.8 38.89,22.86 56.83,22.86 58.9,20.8 77.31,20.8 78.11,21.59 80.8,21.59 81.6,20.8 S2.B2A | U$4.P$2 88.9,59.85 84.93,59.85 82.55,57.47 v77.63,57.47 55.24,57.47 53.34,59.37 40.01,59.37 37.63,61.75 33.66,61.75 U$6.P$2
  Bottom 0.254: v40.48,28.42 38.58,26.51 38.58,23.5 36.83,21.75 36.83,20.8 S1.B2A | v77.63,57.47 77.63,24.77 81.6,20.8 S2.B2A
PWM  (via drill 0.85)
  Bottom 0.254: U1.12 57.72,26.74 v56.79,26.74
R1  (via drill 0.35)
  Top 0.254: v74.45,30.48 72.87,28.89 64.14,28.89 58.9,23.65 58.9,22.86 U1.14 | v89.22,61.59 90.49,62.87 110.56,62.87 121.04,52.39 121.04,45.79 v117.76,42.51
  Bottom 0.254: U1.14 58.74,22.86 53.66,22.86 47.31,29.21 39.66,29.21 38.55,28.1 18.26,28.1 17.11,29.24 17.11,31.16 | 87.55,57.55 86.68,58.42 75.87,58.42 74.45,57 v74.45,30.48 | v89.22,61.59 87.63,60.01 87.63,57.63 87.55,57.55 | CR8.2 17.11,31.16 | 17.11,31.16 17.11,31.61 | CR1.2 116,42.51 v117.76,42.51 | CR12.2 90.52,54.58 87.55,57.55
R2  (via drill 0.35)
  Top 0.254: v78.42,26.35 74.93,22.86 66.52,22.86 U1.15 66.36,22.86 61.91,22.86 v60.48,24.29
  Bottom 0.254: 91.36,40.56 90.96,40.16 83.19,40.16 83.19,31.11 v78.42,26.35 | 91.36,40.56 91.76,40.96 | 37.3,45.41 38.58,44.13 43.97,44.13 43.97,36.2 55.88,24.29 v60.48,24.29 | 37.3,45.41 35.8,46.91 35.8,50.73 33.64,52.89 CR11.2 | CR7.2 33.73,43.93 35.21,45.41 37.3,45.41 | CR2.2 91.92,43.66 91.76,43.5 91.76,42.07 91.28,41.59 91.28,40.64 91.36,40.56
R3  (via drill 0.35)
  Top 0.254: v87,28.42 85.72,27.15 68.26,27.15 66.52,25.4 U1.16 | v40.01,15.72 40.01,18.38 v40.21,18.59 40.01,18.41 33.02,18.41 32.7,18.73 28.73,18.73 v5.56,41.91
  Bottom 0.254: v87,28.42 101.9,28.42 | 101.9,28.42 102.08,28.42 | U1.16 66.36,25.24 58.42,17.3 41.99,17.3 40.4,15.72 v40.01,15.72 | v40.21,18.59 40.21,20.57 CR10.2 | CR3.2 103.19,29.7 101.9,28.42 | v5.56,41.91 5.56,43.02 6.03,43.5 CR6.2
R4  (via drill 0.35)
  Top 0.254: U1.13 58.74,25.24 57.94,25.24 57.94,22.38 58.58,21.75 66.83,21.75 67.31,22.23 83.19,22.23 83.26,22.15 | v86.01,19.88 85.53,19.88 83.26,22.15 | v102.71,54.13 89.85,41.27 89.85,24.44 89.84,24.44 87.62,22.23 83.34,22.23 83.26,22.15
  Bottom 0.254: U1.13 58.74,25.4 55.4,25.4 44.45,36.35 44.45,55.18 36.6,63.02 26.83,63.02 20.09,56.28 CR5.2 | v86.01,19.88 85.53,20.36 CR9.2 | v102.71,54.13 102.71,55.4 CR4.2
RESET  (via drill 0.35)
  Top 0.254: J3.5 81.28,46.67 80.01,47.94 73.18,47.94 66.36,54.77 59.85,54.77 58.9,55.72 U1.1
  Top 0.508: v57.94,58.26 72.05,58.26 R7.2
  Bottom 0.254: v57.94,58.26 58.74,57.47 58.74,55.88 U1.1
RX
  Top 0.254: U1.2 58.9,53.18 60.34,53.18 61.12,52.4 61.12,48.1 60.17,47.15 58.9,47.15 58.1,46.35 53.98,46.35 U$1.D 53.82,46.35 53.5,46.35 51.91,47.94 51.12,47.94 50.16,48.9 43.99,48.9 43.29,48.2 43.29,46.88 44.93,45.24 R19.2
TRIGGER_LEFT  (via drill 0.35)
  Top 0.254: v89.06,38.1 81.76,45.4 74.45,45.4 73.82,46.04 66.83,46.04 66.52,45.72 U1.24
  Bottom 0.254: v89.06,38.1 97.79,38.1 98.42,38.73 98.42,38.89 104.14,44.61 U2.3
TRIGGER_RIGHT  (via drill 0.35)
  Top 0.254: v37.31,44.45 37.62,44.13 40.96,44.13 41.27,43.81 50.96,43.81 51.12,43.97 56.23,43.97 v58.02,42.19 | v60.48,42.07 61.44,43.02 66.36,43.02 U1.23
  Bottom 0.254: v58.02,42.19 58.46,42.19 58.58,42.07 v60.48,42.07 | U3.3 19.21,45.56 20,44.77 20,44.61 25.24,39.37 32.23,39.37 v37.31,44.45
TX  (via drill 0.35)
  Top 0.254: U$5.D 53.82,49.53 57.63,49.53 58.74,50.64 U1.3 | v59.05,44.45 53.98,44.45 52.39,46.04 46.35,46.04 44.93,47.47 R17.2
  Bottom 0.254: v59.05,44.45 59.85,45.24 59.85,49.69 58.9,50.64 U1.3
VCC
  Top 0.508: U5.3 17.14,10.79 18.41,9.53 20.95,9.53 C12.1 21.59,9.53 24.77,9.53 C13.1 25.4,9.53 30.48,9.53 33.02,12.06 57.15,12.06 57.78,12.7 SW9.T12
X_LEFT
  Bottom 0.254: U1.28 66.36,55.72 61.28,50.64 61.28,23.81 55.24,17.78 33.81,17.78 31.27,15.24 31.27,15.08 S1.V2
X_RIGHT
  Bottom 0.254: U1.27 66.52,53.18 72.55,47.15 72.55,19.05 76.2,15.4 76.2,15.08 S2.V2
Y_LEFT
  Bottom 0.254: U1.26 66.36,50.64 65.56,49.85 65.56,27.46 66.48,26.55 66.68,26.55 67.47,25.76 67.47,22.38 61.91,16.83 46.67,16.83 46.67,13.81 40.01,7.14 40.01,6.35 S1.H2
Y_RIGHT
  Bottom 0.254: U1.25 66.52,48.1 72.07,42.55 72.07,14.29 78.42,7.94 84.77,7.94 84.77,6.51 84.93,6.35 S2.H2

### Text on the board
tPlace: ICSP | PWM | BAT | + | - | + | - | Charger | - | +